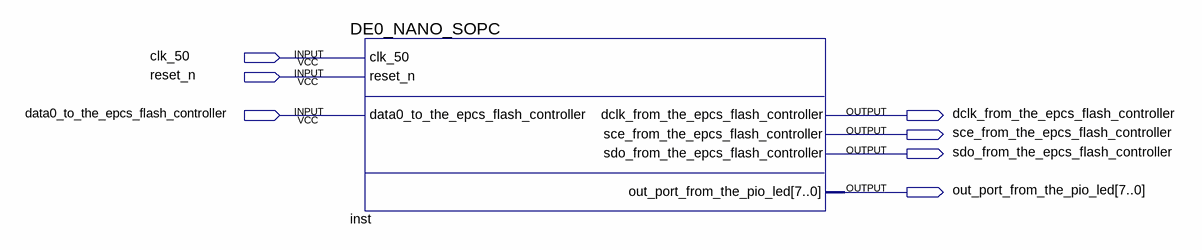
[diagram p0: schematic sheet]
// Quartus schematic mynios2.bdf as structural Verilog: 1 symbols, 7 pins
module mynios2 (
  input  clk_50,
  input  reset_n,
  input  data0_to_the_epcs_flash_controller,
  output dclk_from_the_epcs_flash_controller,
  output sce_from_the_epcs_flash_controller,
  output sdo_from_the_epcs_flash_controller,
  output [7:0] out_port_from_the_pio_led
);

  DE0_NANO_SOPC inst (
    .clk_50(clk_50), .reset_n(reset_n),
    .data0_to_the_epcs_flash_controller(data0_to_the_epcs_flash_controller),
    .dclk_from_the_epcs_flash_controller(dclk_from_the_epcs_flash_controller),
    .sce_from_the_epcs_flash_controller(sce_from_the_epcs_flash_controller),
    .sdo_from_the_epcs_flash_controller(sdo_from_the_epcs_flash_controller),
    .out_port_from_the_pio_led(out_port_from_the_pio_led));
endmodule
